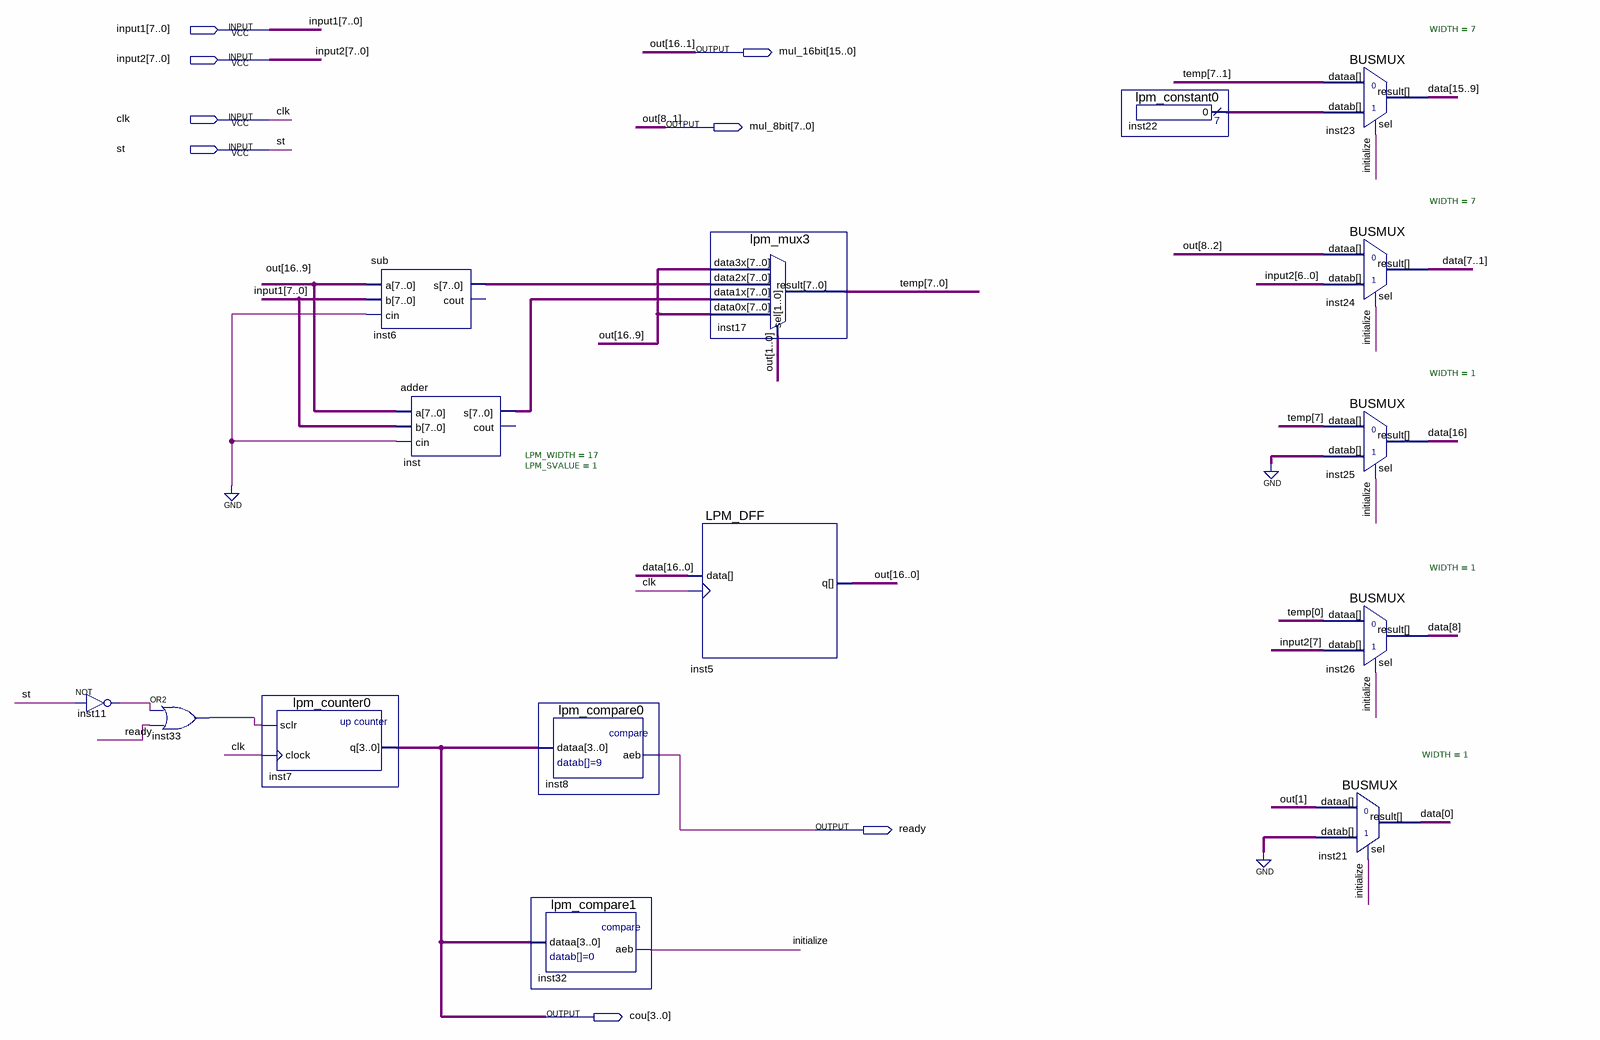
[diagram p0: schematic sheet]
// Quartus schematic test.bdf as structural Verilog: 15 symbols, 8 pins
module test (
  input  [7:0] input1,
  input  [7:0] input2,
  input  clk,
  input  st,
  output [15:0] mul_16bit,
  output [7:0] mul_8bit,
  output ready,
  output [3:0] cou
);

  wire initialize, inst11_out, inst33_out;
  wire [0:0] out;
  wire [6:0] inst22_result;
  wire [7:0] inst6_s, inst_s, temp;
  wire [16:0] data;

  not inst11 (inst11_out, st);
  or inst33 (inst33_out, inst11_out, ready);
  lpm_counter0 inst7 (.sclr(inst33_out), .clock(clk), .q(cou));
  sub inst6 (.a(mul_16bit[15:8]), .b(input1), .cin(1'b0), .s(inst6_s));  // open: cout
  adder inst (.a(mul_16bit[15:8]), .b(input1), .cin(1'b0), .s(inst_s));  // open: cout
  lpm_compare1 inst32 (.dataa(cou), .aeb(initialize));
  lpm_compare0 inst8 (.dataa(cou), .aeb(ready));
  lpm_mux3 inst17 (
    .data3x(mul_16bit[15:8]), .data2x(inst6_s), .data1x(inst_s), .data0x(mul_16bit[15:8]),
    .sel({mul_8bit[0], out[0]}), .result(temp));
  LPM_DFF #(.LPM_WIDTH(17), .LPM_SVALUE(1)) inst5 (.clock(clk), .data(data), .q({mul_16bit[15:8], mul_8bit, out[0]}));
  lpm_constant0 inst22 (.result(inst22_result));
  BUSMUX #(.WIDTH(7)) inst23 (.datab(inst22_result), .sel(initialize), .dataa(temp[7:1]), .result(data[15:9]));
  BUSMUX #(.WIDTH(7)) inst24 (.datab(input2[6:0]), .sel(initialize), .dataa(mul_8bit[7:1]), .result(data[7:1]));
  BUSMUX #(.WIDTH(1)) inst25 (.datab(1'b0), .sel(initialize), .dataa(temp[7]), .result(data[16]));
  BUSMUX #(.WIDTH(1)) inst26 (.datab(input2[7]), .sel(initialize), .dataa(temp[0]), .result(data[8]));
  BUSMUX #(.WIDTH(1)) inst21 (.datab(1'b0), .sel(initialize), .dataa(mul_8bit[0]), .result(data[0]));

  assign mul_16bit[7:0] = mul_8bit;

  // Other names for the same wires on the sheet: out[16:1] = {mul_16bit[15:8], mul_8bit}
endmodule
